# EAGLE design FRAM-SOIC (EAGLE 9.6.2)
PC Engine Joypad Breakout Version 1.0
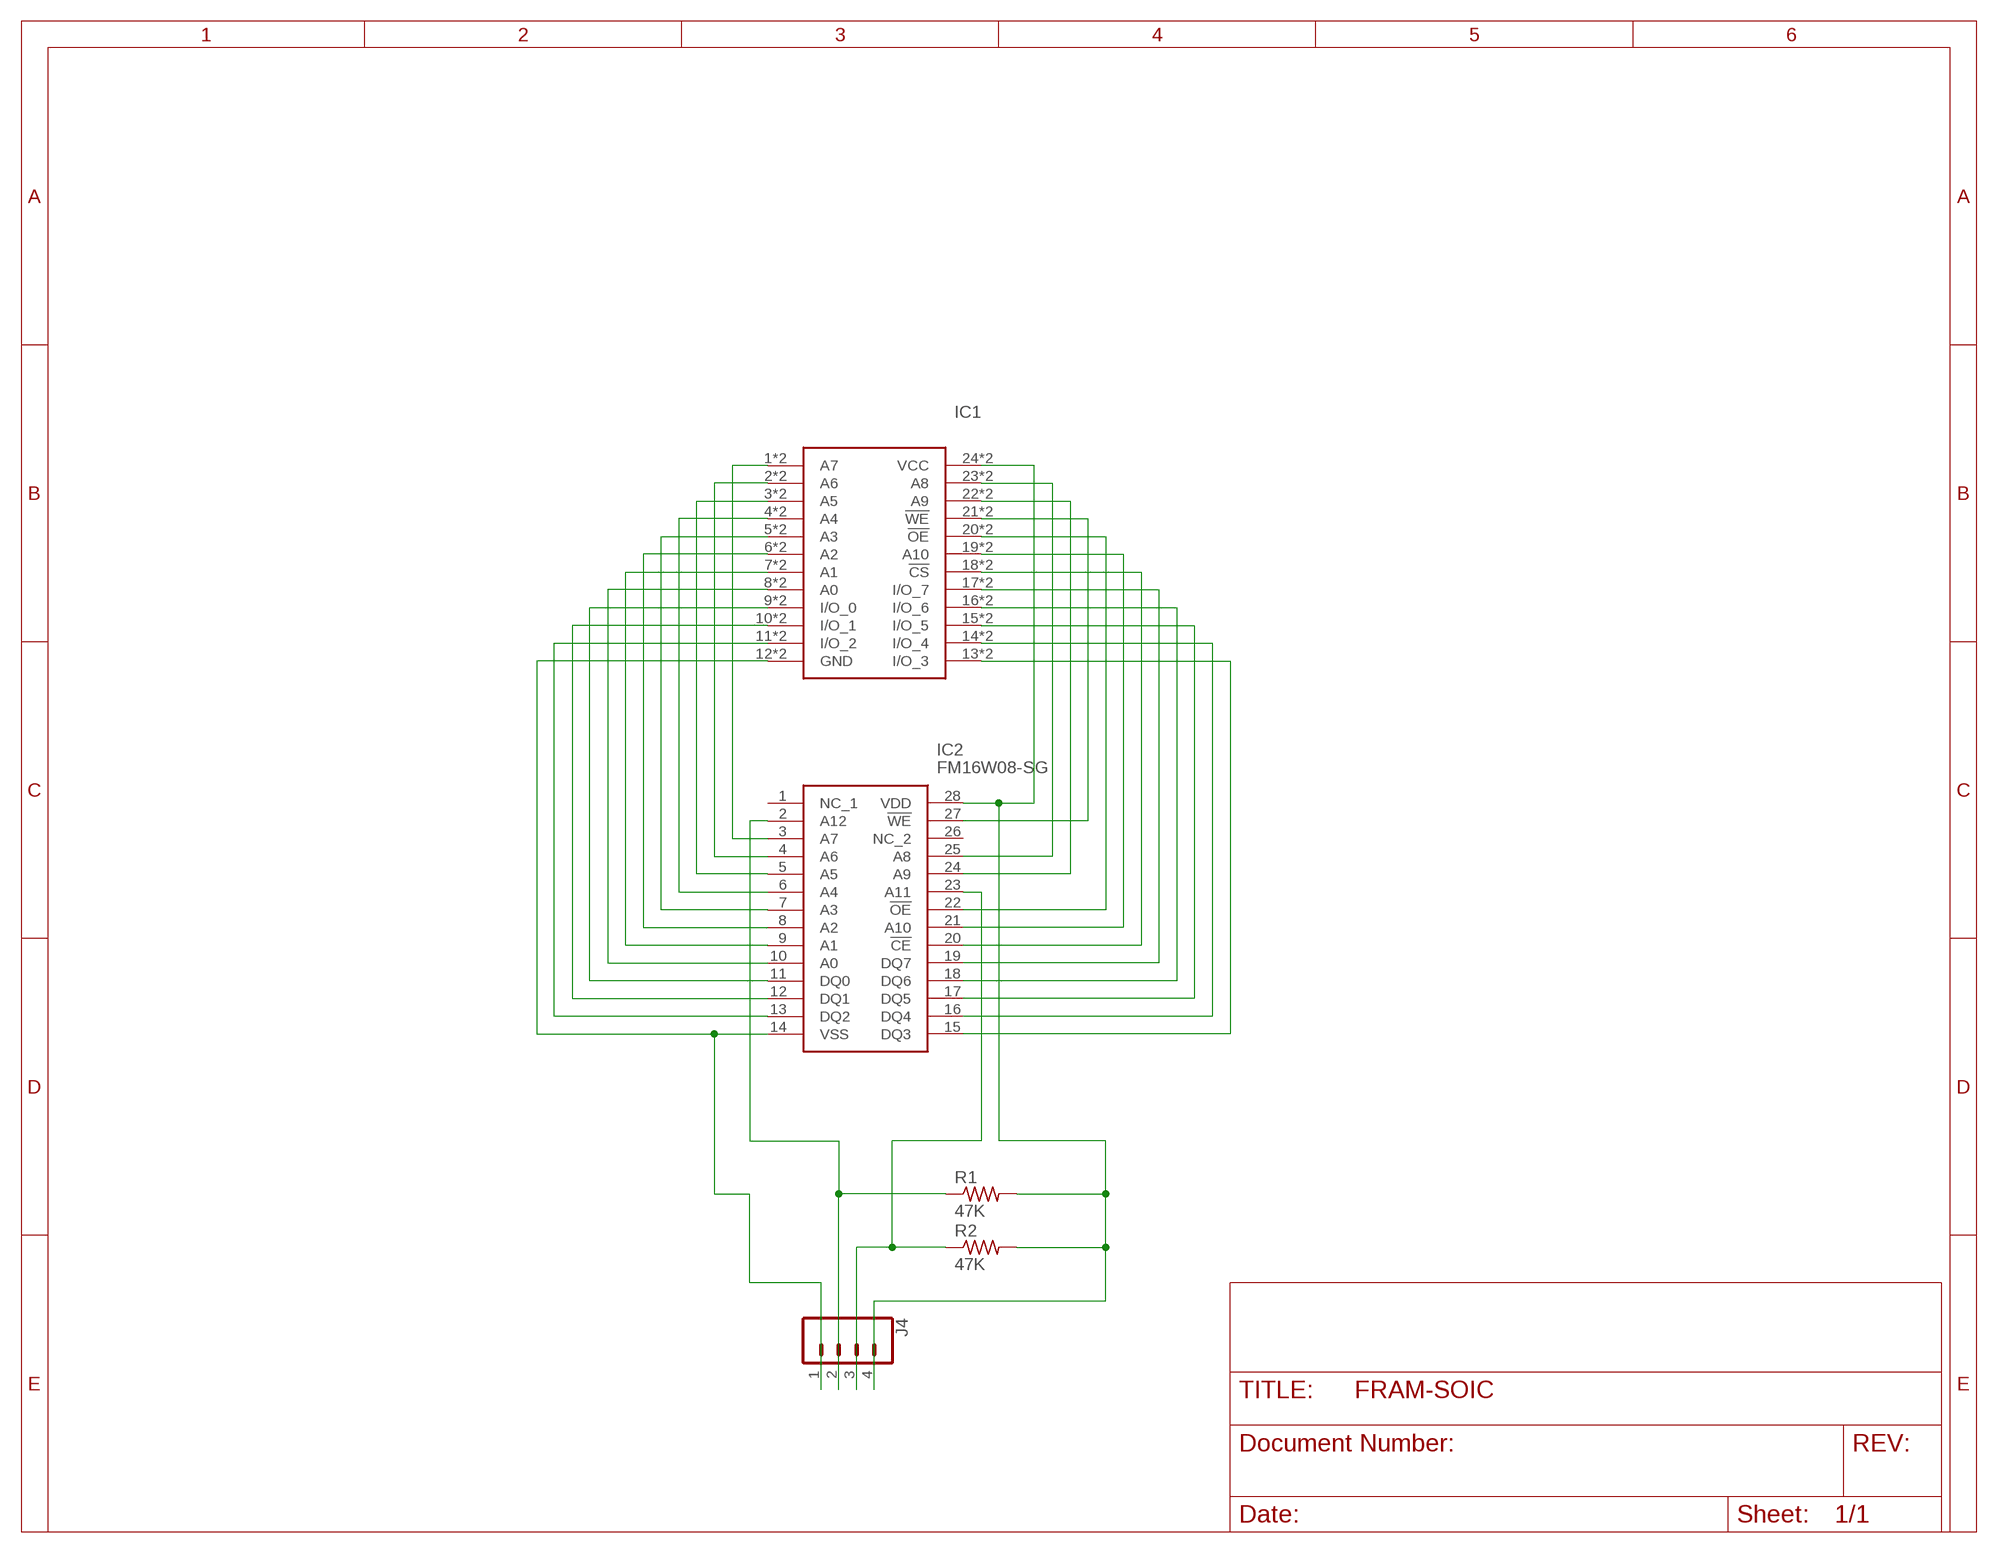
[diagram p0: schematic, sheet 1]

## Parts
IC1  6116SOP-CASTELL  [CASTELL_SOIC-24N]
IC2  FM16W08-SG  [SOIC127P1032X267-28N]
J4  CONN_04SMD_RA_FEMALE  [1X04_SMD_RA_FEMALE]
R1  47K  R-US_R0603  [R0603]
R2  47K  R-US_R0603  [R0603]

## Nets
N$1: IC1.24(VCC) IC1.P$24(VCC) IC2.28(VDD) J4.4 R1.2 R2.2
N$2: IC1.23(A8) IC1.P$23(A8) IC2.25(A8)
N$3: IC1.22(A9) IC1.P$22(A9) IC2.24(A9)
N$4: IC1.21(!WE) IC1.P$21(!WE) IC2.27(!WE)
N$5: IC1.20(!OE) IC1.P$20(!OE) IC2.22(!OE)
N$6: IC1.19(A10) IC1.P$19(A10) IC2.21(A10)
N$7: IC1.18(!CS) IC1.P$18(!CS) IC2.20(!CE)
N$8: IC1.17(I/O_7) IC1.P$17(I/O_7) IC2.19(DQ7)
N$9: IC1.16(I/O_6) IC1.P$16(I/O_6) IC2.18(DQ6)
N$10: IC1.15(I/O_5) IC1.P$15(I/O_5) IC2.17(DQ5)
N$11: IC1.14(I/O_4) IC1.P$14(I/O_4) IC2.16(DQ4)
N$12: IC1.13(I/O_3) IC1.P$13(I/O_3) IC2.15(DQ3)
N$13: IC1.1(A7) IC1.P$1(A7) IC2.3(A7)
N$14: IC1.2(A6) IC1.P$2(A6) IC2.4(A6)
N$15: IC1.3(A5) IC1.P$3(A5) IC2.5(A5)
N$16: IC1.4(A4) IC1.P$4(A4) IC2.6(A4)
N$17: IC1.5(A3) IC1.P$5(A3) IC2.7(A3)
N$18: IC1.6(A2) IC1.P$6(A2) IC2.8(A2)
N$19: IC1.7(A1) IC1.P$7(A1) IC2.9(A1)
N$20: IC1.8(A0) IC1.P$8(A0) IC2.10(A0)
N$21: IC1.9(I/O_0) IC1.P$9(I/O_0) IC2.11(DQ0)
N$22: IC1.10(I/O_1) IC1.P$10(I/O_1) IC2.12(DQ1)
N$23: IC1.11(I/O_2) IC1.P$11(I/O_2) IC2.13(DQ2)
N$24: IC2.2(A12) J4.2 R1.1
N$28: IC1.12(GND) IC1.P$12(GND) IC2.14(VSS) J4.1
N$31: IC2.23(A11) J4.3 R2.1
Unconnected: IC2.1(NC_1) IC2.26(NC_2)

## Library data of the parts
IC1 = PC-Engine:6116SOP-CASTELL: Castellated pinout and plan for a SURFACE MOUNT 2KB SRAM as used in the TurboDuo and other machines
IC2 = PC-Engine:FM16W08-SG: Cypress Semiconductor FM16W08-SG Parallel FRAM Memory, 64kbit, 70ns, 2.7 5.5 V SOIC 28-Pin Source: Datasheet <https://componentsearchengine.com/Datasheets/2/FM16W08-SG.pdf>; ARROW_PART_NUMBER: FM16W08-SG; ARROW_PRICE-STOCK: https://www.arrow.com/en/products/fm16w08-sg/cypress-semiconductor; DESCRIPTION: Cypress Semiconductor FM16W08-SG Parallel FRAM Memory, 64kbit, 70ns, 2.7 5.5 V SOIC 28-Pin; HEIGHT: 2.67mm; MANUFACTURER_NAME: Cypress Semiconductor; MANUFACTURER_PART_NUMBER: FM16W08-SG; MOUSER_PART_NUMBER: 877-FM16W08-SG; MOUSER_PRICE-STOCK: https://www.mouser.co.uk/ProductDetail/Cypress-Semiconductor/FM16W08-SG?qs=pA5MXup5wxHu1%2FuRaosnLA%3D%3D
J4 = SparkFun-Connectors:CONN_04: Multi connection point. Often used as Generic Header-pin footprint for 0.1 inch spaced/style header connections On any of the 0.1 inch spaced packages, you can populate with these: Break Away Headers - Straight <https://www.sparkfun.com/products/116> (PRT-00116) Break Away Male Headers - Right Angle <https://www.sparkfun.com/products/553> (PRT-00553) Female Headers <https://www.sparkfun.com/products/115> (PRT-00115) Break Away Headers - Machine Pin <https://www.sparkfun.com/products/117> (PRT-00117) Break Away Female Headers - Swiss Machine Pin <https://www.sparkfun.com/products/743> (PRT-00743) For SCREWTERMINALS and SPRING TERMINALS visit here: Screw Terimnals on SparkFun.com <https://www.sparkfun.com/search/results?term=Screw+Terminals> (5mm/3.5mm/2.54mm spacing) This device is also useful as a general connection point to wire up your design to another part of your project. Our various solder wires solder well into these plated through hole pads. Hook-Up Wire - Assortment (Stranded, 22 AWG) <https://www.sparkfun.com/products/11375> (PRT-11375) Hook-Up Wire - Assortment (Solid Core, 22 AWG) <https://www.sparkfun.com/products/11367> (PRT-11367) View the entire wire category on our website here <https://www.sparkfun.com/categories/141> Special notes: Molex polarized connector foot print use with SKU : PRT-08231 with associated crimp pins and housings. 1MM SMD Version SKU: PRT-10208; PROD_ID: CONN-12382
R1 R2 = resistor:R-US_: RESISTOR, American symbol

## Net classes
0 default: width 0.203 mm, drill 0.356 mm, clearance 0.203 mm
1 breadboard: width 1.016 mm, drill 0.356 mm, clearance 0.305 mm
2 power: width 0.305 mm, drill 0.356 mm, clearance 0.305 mm
3 signal: width 0.203 mm, drill 0.356 mm, clearance 0.203 mm

## Board
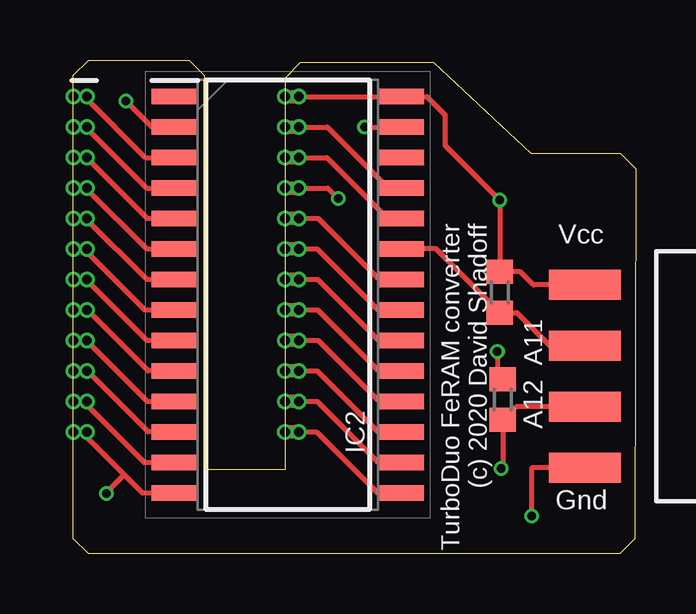
[diagram p1: board, top side]
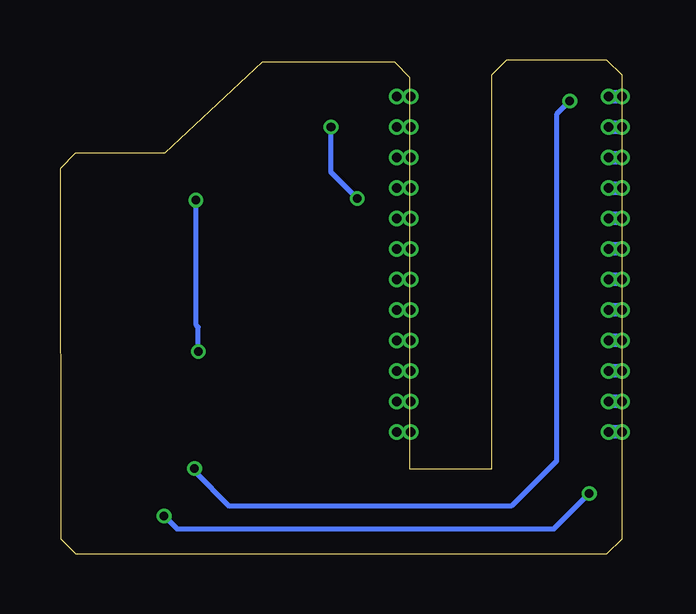
[diagram p2: board, bottom side, seen from below]

Size 23.44 x 20.57 mm. Coordinates in mm from the lower left corner, seen from the top.
Outline: 22.78,0 0.64,0 0,0.64 0,19.94 0.64,20.57 4.83,20.57 5.46,19.94 5.46,3.53 8.84,3.53 8.84,19.84 9.47,20.47 15.01,20.47 19.08,16.69 22.81,16.69 23.44,16.05 23.42,0.64 22.78,0
Copper layers (1*16): Top 0.035mm / dielectric 1.5mm / Bottom 0.035mm
Design rules "default *": minimum track width 6mil, minimum drill 0.35mm, track to track 3mil, track to pad 3mil, pad to pad 3mil, via to via 3mil, smd to smd 3mil, copper to edge 3mil, drill to drill 3mil, minimum pad ring 5mil, minimum via ring 5mil, stop-mask expansion 1mil, vias tented up to drill 15mil, thermal gap 10mil

### Footprints (pad centres in the part's own frame; a part is rotated, then mirrored left to right if it is on the bottom)
CASTELL_SOIC-24N = drill 0.4 pad 0.6: 1 -4.699,6.985; 2 -4.699,5.715; 3 -4.699,4.445; 4 -4.699,3.175; 5 -4.699,1.905; 6 -4.699,0.635; 7 -4.699,-0.635; 8 -4.699,-1.905; 9 -4.699,-3.175; 10 -4.699,-4.445; 11 -4.699,-5.715; 12 -4.699,-6.985; 13 4.699,-6.985; 14 4.699,-5.715; 15 4.699,-4.445; 16 4.699,-3.175; 17 4.699,-1.905; 18 4.699,-0.635; 19 4.699,0.635; 20 4.699,1.905; 21 4.699,3.175; 22 4.699,4.445; 23 4.699,5.715; 24 4.699,6.985 | drill 0.4 pad 0.61: P$1 -4.128,6.985; P$2 -4.128,5.715; P$3 -4.128,4.445; P$4 -4.128,3.175; P$5 -4.128,1.905; P$6 -4.128,0.635; P$7 -4.128,-0.635; P$8 -4.128,-1.905; P$9 -4.128,-3.175; P$10 -4.128,-4.445; P$11 -4.128,-5.715; P$12 -4.128,-6.985; P$13 4.128,-6.985; P$14 4.128,-5.715; P$15 4.128,-4.445; P$16 4.128,-3.175; P$17 4.128,-1.905; P$18 4.128,-0.635; P$19 4.128,0.635; P$20 4.128,1.905; P$21 4.128,3.175; P$22 4.128,4.445; P$23 4.128,5.715; P$24 4.128,6.985
SOIC127P1032X267-28N = smd 1.922 x 0.65: 1 -4.714,8.255; 2 -4.714,6.985; 3 -4.714,5.715; 4 -4.714,4.445; 5 -4.714,3.175; 6 -4.714,1.905; 7 -4.714,0.635; 8 -4.714,-0.635; 9 -4.714,-1.905; 10 -4.714,-3.175; 11 -4.714,-4.445; 12 -4.714,-5.715; 13 -4.714,-6.985; 14 -4.714,-8.255; 15 4.714,-8.255; 16 4.714,-6.985; 17 4.714,-5.715; 18 4.714,-4.445; 19 4.714,-3.175; 20 4.714,-1.905; 21 4.714,-0.635; 22 4.714,0.635; 23 4.714,1.905; 24 4.714,3.175; 25 4.714,4.445; 26 4.714,5.715; 27 4.714,6.985; 28 4.714,8.255
1X04_SMD_RA_FEMALE = smd 1.25 x 3: 1 -3.81,7.225; 2 -1.27,7.225; 3 1.27,7.225; 4 3.81,7.225
R0603 = smd 1 x 1.1: 1 -0.85,0; 2 0.85,0

### Placement (x,y rotation side)
IC1  4.7,12.06 0 top
IC2  8.94,10.79 0 top
J4  28.55,7.39 90 top
R1  17.91,6.43 90 top
R2  17.78,10.9 90 top

### Tracks (layer width: path | path; a pad name or v marks a point on that pad's centre or on a via)
N$1  (via drill 0.36)
  Top 0.203: IC1.24 IC2.28 14.75,19.05 15.49,18.3 15.49,17.02 v17.78,14.73 R2.2 18.65,11.75 19.19,11.2 J4.4 | R1.2 17.68,7.5 v17.68,8.43
  Top 0.559: IC1.24 IC1.P$24
  Bottom 0.203: v17.68,8.43 17.68,9.45 17.78,9.55 v17.78,14.73
N$2
  Top 0.203: IC1.23 10.59,17.78 13.13,15.24 IC2.25
  Top 0.559: IC1.23 IC1.P$23
N$3
  Top 0.203: IC1.22 10.57,16.51 13.11,13.97 IC2.24
  Top 0.559: IC1.22 IC1.P$22
N$4  (via drill 0.36)
  Top 0.203: IC1.21 10.62,15.24 v11.05,14.81 | v12.14,17.78 IC2.27
  Top 0.559: IC1.21 IC1.P$21
  Bottom 0.203: v11.05,14.81 12.14,15.9 v12.14,17.78
N$5
  Top 0.203: IC1.20 10.21,13.97 12.75,11.43 IC2.22
  Top 0.559: IC1.20 IC1.P$20
N$6
  Top 0.203: IC1.19 10.16,12.7 12.7,10.16 IC2.21
  Top 0.559: IC1.19 IC1.P$19
N$7
  Top 0.203: IC1.18 10.19,11.43 12.72,8.89 IC2.20
  Top 0.559: IC1.18 IC1.P$18
N$8
  Top 0.203: IC1.17 10.19,10.16 12.72,7.62 IC2.19
  Top 0.559: IC1.17 IC1.P$17
N$9
  Top 0.203: IC1.16 10.21,8.89 12.75,6.35 IC2.18
  Top 0.559: IC1.16 IC1.P$16
N$10
  Top 0.203: IC1.15 10.16,7.62 12.7,5.08 IC2.17
  Top 0.559: IC1.15 IC1.P$15
N$11
  Top 0.203: IC1.14 10.16,6.35 12.7,3.81 IC2.16
  Top 0.559: IC1.14 IC1.P$14
N$12
  Top 0.203: IC1.13 10.13,5.08 12.68,2.54 IC2.15
  Top 0.559: IC1.13 IC1.P$13
N$13
  Top 0.203: IC2.3 3,16.51 0.57,18.94 IC1.P$1
  Bottom 0.559: IC1.P$1 IC1.1
N$14
  Top 0.203: IC2.4 3.05,15.24 0.57,17.72 IC1.P$2
  Bottom 0.559: IC1.P$2 IC1.2
N$15
  Top 0.203: IC2.5 3.07,13.97 0.57,16.47 IC1.P$3
  Bottom 0.559: IC1.P$3 IC1.3
N$16
  Top 0.203: IC2.6 3.05,12.7 0.57,15.18 IC1.P$4
  Bottom 0.559: IC1.P$4 IC1.4
N$17
  Top 0.203: IC2.7 3.05,11.43 0.57,13.91 IC1.P$5
  Bottom 0.559: IC1.P$5 IC1.5
N$18
  Top 0.203: IC2.8 2.97,10.16 0.57,12.56 IC1.P$6
  Bottom 0.559: IC1.P$6 IC1.6
N$19
  Top 0.203: IC2.9 3.05,8.89 0.57,11.37 IC1.P$7
  Bottom 0.559: IC1.P$7 IC1.7
N$20
  Top 0.203: IC1.P$8 3.11,7.62 IC2.10
  Bottom 0.559: IC1.P$8 IC1.8
N$21
  Top 0.203: IC2.11 3.07,6.35 0.57,8.85 IC1.P$9
  Bottom 0.559: IC1.P$9 IC1.9
N$22
  Top 0.203: IC1.P$10 3.11,5.08 IC2.12
  Bottom 0.559: IC1.P$10 IC1.10
N$23
  Top 0.203: IC2.13 2.95,3.81 0.57,6.18 IC1.P$11
  Bottom 0.559: IC1.P$11 IC1.11
N$24  (via drill 0.36)
  Top 0.203: IC2.2 3.28,17.78 v2.18,18.87 | J4.2 18.45,6.12 R1.1 17.91,3.63 v17.83,3.56
  Bottom 0.203: v2.18,18.87 2.74,18.31 2.74,3.86 4.62,1.98 16.38,1.98 17.83,3.43 v17.83,3.56
N$28  (via drill 0.36)
  Top 0.203: IC2.14 2.87,2.54 2.12,3.29 | v1.37,2.52 1.37,2.54 2.12,3.29 | J4.1 19.1,3.58 v19.1,1.57 | 2.12,3.29 0.57,4.84 IC1.P$12
  Bottom 0.203: v1.37,2.52 2.85,1.04 18.57,1.04 v19.1,1.57
  Bottom 0.559: IC1.P$12 IC1.12
N$31
  Top 0.203: J4.3 19.88,8.66 18.49,10.05 R2.1 15.13,12.7 IC2.23

### Text on the board
tNames: TurboDuo FeRAM converter / (c) 2020 David Shadoff | Vcc | A11 | A12 | Gnd